# Altium schematic sheet RAM.SchDoc
size A3; SheetNumber: 2; SheetTotal: 6
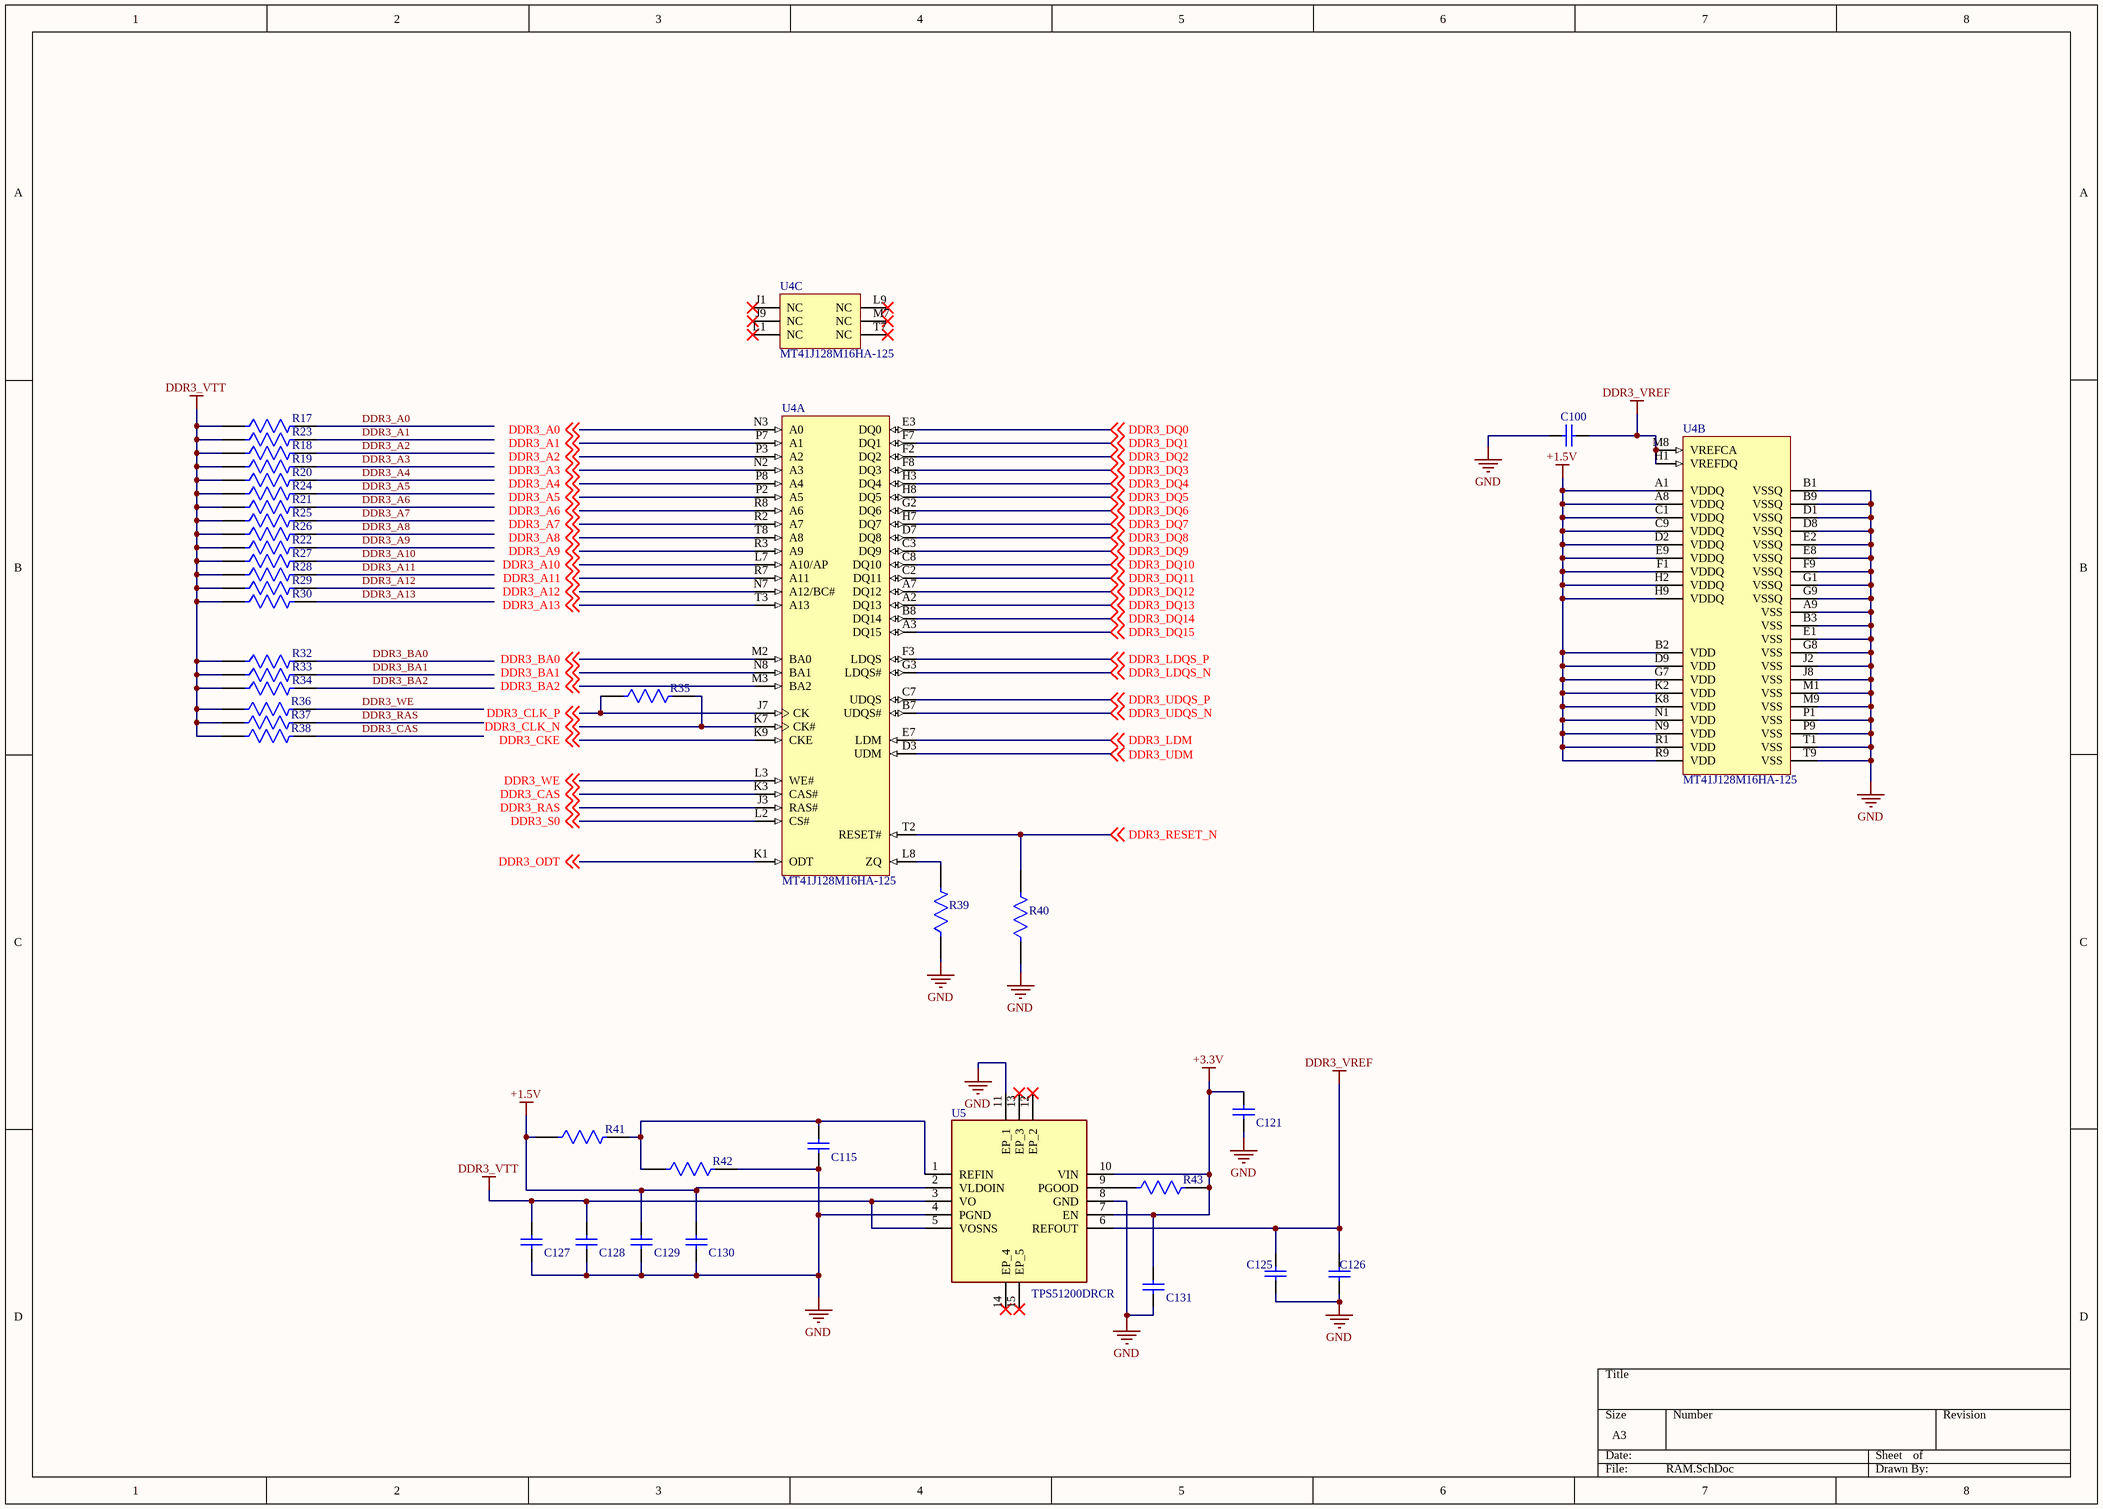
[diagram p0: RAM.SchDoc]

## Parts
C100  VJ0805Y152KXAAC  [CAPC2013X145X48NL20T23]  (value not drawn)
C115  VJ0805Y152KXAAC  [CAPC2013X145X48NL20T23]  (value not drawn)
C121  VJ0805Y152KXAAC  [CAPC2013X145X48NL20T23]  (value not drawn)
C125  VJ0805Y152KXAAC  [CAPC2013X145X48NL20T23]  (value not drawn)
C126  VJ0805Y152KXAAC  [CAPC2013X145X48NL20T23]  (value not drawn)
C127  VJ0805Y152KXAAC  [CAPC2013X145X48NL20T23]  (value not drawn)
C128  VJ0805Y152KXAAC  [CAPC2013X145X48NL20T23]  (value not drawn)
C129  VJ0805Y152KXAAC  [CAPC2013X145X48NL20T23]  (value not drawn)
C130  VJ0805Y152KXAAC  [CAPC2013X145X48NL20T23]  (value not drawn)
C131  VJ0805Y152KXAAC  [CAPC2013X145X48NL20T23]  (value not drawn)
R17  MCU0805MD4991BP100  [FP-MCU0805-MFG]  (value not drawn)
R18  MCU0805MD4991BP100  [FP-MCU0805-MFG]  (value not drawn)
R19  MCU0805MD4991BP100  [FP-MCU0805-MFG]  (value not drawn)
R20  MCU0805MD4991BP100  [FP-MCU0805-MFG]  (value not drawn)
R21  MCU0805MD4991BP100  [FP-MCU0805-MFG]  (value not drawn)
R22  MCU0805MD4991BP100  [FP-MCU0805-MFG]  (value not drawn)
R23  MCU0805MD4991BP100  [FP-MCU0805-MFG]  (value not drawn)
R24  MCU0805MD4991BP100  [FP-MCU0805-MFG]  (value not drawn)
R25  MCU0805MD4991BP100  [FP-MCU0805-MFG]  (value not drawn)
R26  MCU0805MD4991BP100  [FP-MCU0805-MFG]  (value not drawn)
R27  MCU0805MD4991BP100  [FP-MCU0805-MFG]  (value not drawn)
R28  MCU0805MD4991BP100  [FP-MCU0805-MFG]  (value not drawn)
R29  MCU0805MD4991BP100  [FP-MCU0805-MFG]  (value not drawn)
R30  MCU0805MD4991BP100  [FP-MCU0805-MFG]  (value not drawn)
R32  MCU0805MD4991BP100  [FP-MCU0805-MFG]  (value not drawn)
R33  MCU0805MD4991BP100  [FP-MCU0805-MFG]  (value not drawn)
R34  MCU0805MD4991BP100  [FP-MCU0805-MFG]  (value not drawn)
R35  MCU0805MD4991BP100  [FP-MCU0805-MFG]  (value not drawn)
R36  MCU0805MD4991BP100  [FP-MCU0805-MFG]  (value not drawn)
R37  MCU0805MD4991BP100  [FP-MCU0805-MFG]  (value not drawn)
R38  MCU0805MD4991BP100  [FP-MCU0805-MFG]  (value not drawn)
R39  MCU0805MD4991BP100  [FP-MCU0805-MFG]  (value not drawn)
R40  MCU0805MD4991BP100  [FP-MCU0805-MFG]  (value not drawn)
R41  MCU0805MD4991BP100  [FP-MCU0805-MFG]  (value not drawn)
R42  MCU0805MD4991BP100  [FP-MCU0805-MFG]  (value not drawn)
R43  MCU0805MD4991BP100  [FP-MCU0805-MFG]  (value not drawn)
U4  MT41J128M16HA-125  [MICT-HA-96]  (parts A,B,C of 3)
U5  TPS51200DRCR  [TPS51200DRCR]

## Nets
+1.5V: C129.2 C130.2 R41.1 U4.A1(VDDQ) U4.A8(VDDQ) U4.B2(VDD) U4.C1(VDDQ) U4.C9(VDDQ) U4.D2(VDDQ) U4.D9(VDD) U4.E9(VDDQ) U4.F1(VDDQ) U4.G7(VDD) U4.H2(VDDQ) U4.H9(VDDQ) U4.K2(VDD) U4.K8(VDD) U4.N1(VDD) U4.N9(VDD) U4.R1(VDD) U4.R9(VDD) U5.2(VLDOIN)
+3.3V: C121.2 C131.2 R43.2 U5.7(EN) U5.10(VIN)
DDR3_VREF: C100.1 C125.2 C126.2 U4.H1(VREFDQ) U4.M8(VREFCA) U5.6(REFOUT)
DDR3_VTT: C127.2 C128.2 R17.1 R18.1 R19.1 R20.1 R21.1 R22.1 R23.1 R24.1 R25.1 R26.1 R27.1 R28.1 R29.1 R30.1 R32.1 R33.1 R34.1 R36.1 R37.1 R38.1 U5.3(VO) U5.5(VOSNS)
GND: C100.2 C115.1 C121.1 C125.1 C126.1 C127.1 C128.1 C129.1 C130.1 C131.1 R39.1 R40.1 R42.2 U4.A9(VSS) U4.B1(VSSQ) U4.B3(VSS) U4.B9(VSSQ) U4.D1(VSSQ) U4.D8(VSSQ) U4.E1(VSS) U4.E2(VSSQ) U4.E8(VSSQ) U4.F9(VSSQ) U4.G1(VSSQ) U4.G8(VSS) U4.G9(VSSQ) U4.J2(VSS) U4.J8(VSS) U4.M1(VSS) U4.M9(VSS) U4.P1(VSS) U4.P9(VSS) U4.T1(VSS) U4.T9(VSS) U5.4(PGND) U5.8(GND) U5.11(EP_1)
DDR3_A0: R17.2 U4.N3(A0) ; off-sheet DDR3_A0
DDR3_A1: R23.2 U4.P7(A1) ; off-sheet DDR3_A1
DDR3_A2: R18.2 U4.P3(A2) ; off-sheet DDR3_A2
DDR3_A3: R19.2 U4.N2(A3) ; off-sheet DDR3_A3
DDR3_A4: R20.2 U4.P8(A4) ; off-sheet DDR3_A4
DDR3_A5: R24.2 U4.P2(A5) ; off-sheet DDR3_A5
DDR3_A6: R21.2 U4.R8(A6) ; off-sheet DDR3_A6
DDR3_A7: R25.2 U4.R2(A7) ; off-sheet DDR3_A7
DDR3_A8: R26.2 U4.T8(A8) ; off-sheet DDR3_A8
DDR3_A9: R22.2 U4.R3(A9) ; off-sheet DDR3_A9
DDR3_A10: R27.2 U4.L7(A10/AP) ; off-sheet DDR3_A10
DDR3_A11: R28.2 U4.R7(A11) ; off-sheet DDR3_A11
DDR3_A12: R29.2 U4.N7(A12/BC#) ; off-sheet DDR3_A12
DDR3_A13: R30.2 U4.T3(A13) ; off-sheet DDR3_A13
DDR3_BA0: R32.2 U4.M2(BA0) ; off-sheet DDR3_BA0
DDR3_BA1: R33.2 U4.N8(BA1) ; off-sheet DDR3_BA1
DDR3_BA2: R34.2 U4.M3(BA2) ; off-sheet DDR3_BA2
DDR3_CAS: R38.2 U4.K3(CAS#) ; off-sheet DDR3_CAS
DDR3_CKE: U4.K9(CKE) ; off-sheet DDR3_CKE
DDR3_CLK_N: R35.2 U4.K7(CK#) ; off-sheet DDR3_CLK_N
DDR3_CLK_P: R35.1 U4.J7(CK) ; off-sheet DDR3_CLK_P
DDR3_DQ0: U4.E3(DQ0) ; off-sheet DDR3_DQ0
DDR3_DQ1: U4.F7(DQ1) ; off-sheet DDR3_DQ1
DDR3_DQ2: U4.F2(DQ2) ; off-sheet DDR3_DQ2
DDR3_DQ3: U4.F8(DQ3) ; off-sheet DDR3_DQ3
DDR3_DQ4: U4.H3(DQ4) ; off-sheet DDR3_DQ4
DDR3_DQ5: U4.H8(DQ5) ; off-sheet DDR3_DQ5
DDR3_DQ6: U4.G2(DQ6) ; off-sheet DDR3_DQ6
DDR3_DQ7: U4.H7(DQ7) ; off-sheet DDR3_DQ7
DDR3_DQ8: U4.D7(DQ8) ; off-sheet DDR3_DQ8
DDR3_DQ9: U4.C3(DQ9) ; off-sheet DDR3_DQ9
DDR3_DQ10: U4.C8(DQ10) ; off-sheet DDR3_DQ10
DDR3_DQ11: U4.C2(DQ11) ; off-sheet DDR3_DQ11
DDR3_DQ12: U4.A7(DQ12) ; off-sheet DDR3_DQ12
DDR3_DQ13: U4.A2(DQ13) ; off-sheet DDR3_DQ13
DDR3_DQ14: U4.B8(DQ14) ; off-sheet DDR3_DQ14
DDR3_DQ15: U4.A3(DQ15) ; off-sheet DDR3_DQ15
DDR3_LDM: U4.E7(LDM) ; off-sheet DDR3_LDM
DDR3_LDQS_N: U4.G3(LDQS#) ; off-sheet DDR3_LDQS_N
DDR3_LDQS_P: U4.F3(LDQS) ; off-sheet DDR3_LDQS_P
DDR3_ODT: U4.K1(ODT) ; off-sheet DDR3_ODT
DDR3_RAS: R37.2 U4.J3(RAS#) ; off-sheet DDR3_RAS
DDR3_RESET_N: R40.2 U4.T2(RESET#) ; off-sheet DDR3_RESET_N
DDR3_S0: U4.L2(CS#) ; off-sheet DDR3_S0
DDR3_UDM: U4.D3(UDM) ; off-sheet DDR3_UDM
DDR3_UDQS_N: U4.B7(UDQS#) ; off-sheet DDR3_UDQS_N
DDR3_UDQS_P: U4.C7(UDQS) ; off-sheet DDR3_UDQS_P
DDR3_WE: R36.2 U4.L3(WE#) ; off-sheet DDR3_WE
NetC115_2: C115.2 R41.2 R42.1 U5.1(REFIN)
NetR39_2: R39.2 U4.L8(ZQ)
NetR43_1: R43.1 U5.9(PGOOD)

Not connected (* = marked no-connect by the designer): U4 J1(NC)* J9(NC)* L1(NC)* L9(NC)* M7(NC)* T7(NC)*; U5 12(EP_2)* 13(EP_3)* 14(EP_4)* 15(EP_5)*

## Library data of the parts
C100 C115 C121 C125-C131 = CMP-2007-01729-1: Manufacturer: Vitramon; Part Number: VJ0805Y152KXAAC
R17-R30 R32-R43 = CMP-02407-000217-1: RES 1.05K OHM 0.5% 1/5W 0805; Resistance: 4.99kR; Power Rating: 200mW; Tolerance: 0.1%; Voltage Rating: 150V; Weight: 0.000194oz; Package Quantity: 1000; Height: 0.52mm; Case Code (Imperial): 0805; Width: 1.25mm; Packaging: Tape and Reel; Case/Package: 0805; Length: 2mm; Composition: Thin Film; Termination: SMD/SMT; Min Operating Temperature: -55°C; Case Code (Metric): 2012; Max Operating Temperature: 155°C
U4 = CMP-0355-00025-1: 2Gb DDR3-1600 SDRAM, 128Mb x 16, 1.25ns, 1.5V, 0 to 95 degC, 96-Ball FBGA, Pb-Free; Manufacturer: Micron; Clock Rate: 800 MHzÂ; Op. Temp.: 0C to +95CÂ; Data Rate: DDR3-1600Â; Density: 2GbÂ; Voltage: 1.5VÂ; CL: CL = 11Â; Cycle Time: 1.25nsÂ; Pin Count: 96-ballÂ; Depth: 128MbÂ; DatasheetVersion: Rev. P; ComponentLink1URL: http://www.micron.com/; Mounting Technology: Surface Mount; PackageVersion: Rev.E; ComponentLink3URL: http://www.micron.com/~/media/Documents/Products/Data%20Sheet/DRAM/4Gb_1_35V_DDR3L.pdf; RoHS: YesÂ; ComponentLink2URL: http://www.micron.com/~/media/Documents/Products/Data%20Sheet/DRAM/2Gb_DDR3_SDRAM.pdf; PartNumber: MT41J128M16HA-125; ComponentLink3Description: Package Specification; ComponentLink1Description: Manufacturer URL; PackageDescription: 96-Ball Fine-Pitch Ball Grid Array, 14 x 9 mm, Pitch 0.8 mm; PackageReference: MICT-HA-96; Width: x16Â; Package: FBGAÂ; ComponentLink2Description: Datasheet
U5 = TPS51200DRCR: Integrated Circuit; Manufacturer_Name: Texas Instruments; Datasheet Link: https://www.ti.com/lit/gpn/tps51200?HQS=ti-null-null-sf-df-pf-sep-wwe&DCM=yes; Height: 1mm; Manufacturer_Part_Number: TPS51200DRCR; Mouser Part Number: 595-TPS51200DRCR; Mouser Price/Stock: https://www.mouser.co.uk/ProductDetail/Texas-Instruments/TPS51200DRCR?qs=WxL8HmPi5r54D5pDlo3K5g%3D%3D; Arrow Part Number: TPS51200DRCR; Arrow Price/Stock: https://www.arrow.com/en/products/tps51200drcr/texas-instruments?region=nac